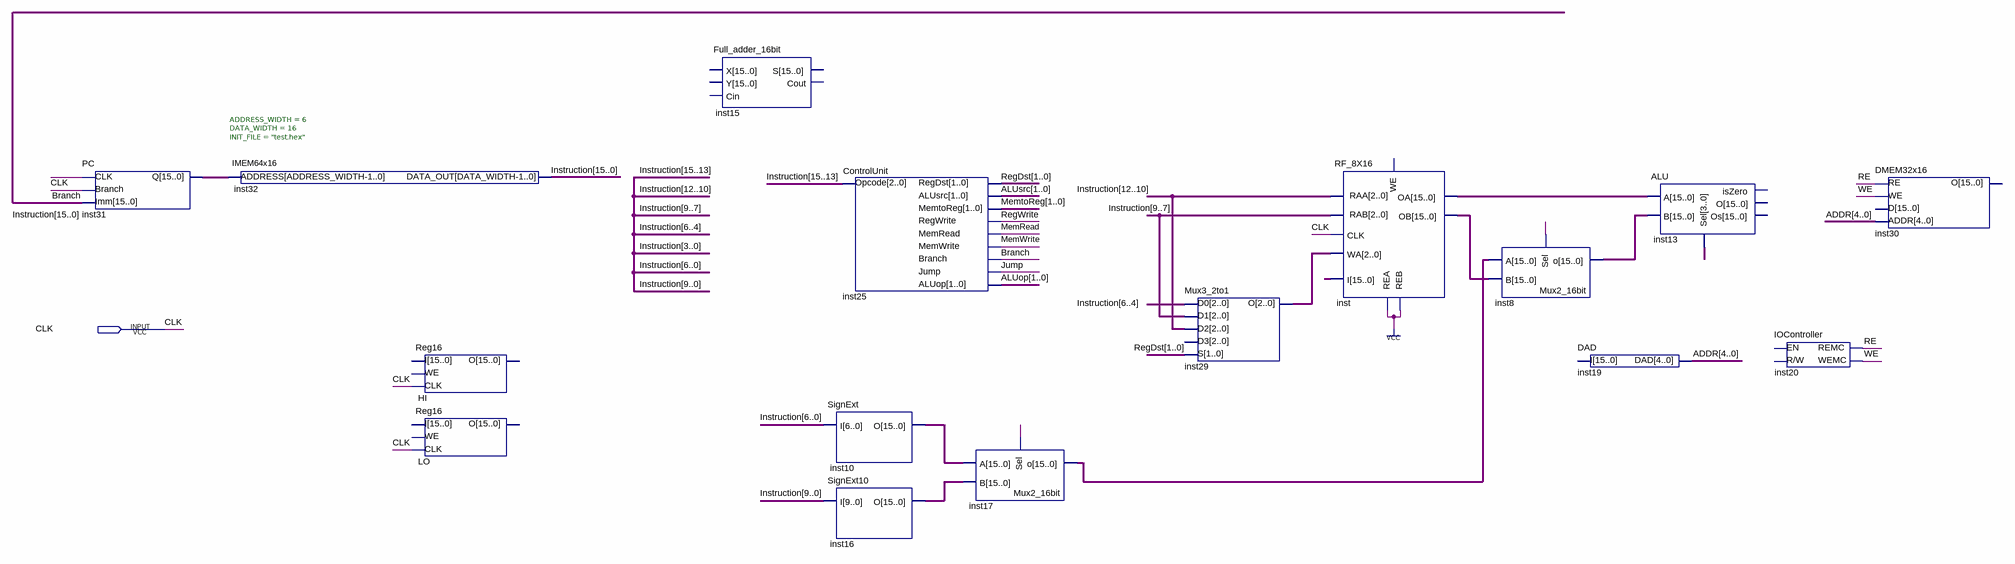
[diagram p0: schematic sheet]
// Quartus schematic CPUTopDesign_sub.bdf as structural Verilog: 16 symbols, 1 pins
module CPUTopDesign_sub (
  input  CLK
);

  wire Branch, Jump, MemRead, MemWrite, RE, RegWrite, undriven, undriven_3, WE;
  wire [1:0] ALUop, ALUsrc, MemtoReg, RegDst;
  wire [2:0] inst29_o;
  wire [3:0] undriven_2;
  wire [4:0] ADDR;
  wire [15:0] inst8_o, inst10_o, inst16_o, inst17_o, inst31_q, inst_oa, inst_ob, Instruction, undriven_4;

  PC inst31 (.CLK(CLK), .Branch(Branch), .Imm(Instruction), .Q(inst31_q));
  IMEM64x16 #(.ADDRESS_WIDTH(6), .DATA_WIDTH(16), .INIT_FILE("test.hex")) inst32 (
    .ADDRESS(inst31_q), .DATA_OUT(Instruction));
  Reg16 HI (.CLK(CLK));  // open: WE, I, O
  Reg16 LO (.CLK(CLK));  // open: WE, I, O
  Full_adder_16bit inst15 ();  // open: X, Y, Cin, S, Cout
  SignExt inst10 (.I(Instruction[6:0]), .O(inst10_o));
  SignExt10 inst16 (.I(Instruction[9:0]), .O(inst16_o));
  ControlUnit inst25 (
    .Opcode(Instruction[15:13]), .RegDst(RegDst), .ALUsrc(ALUsrc), .MemtoReg(MemtoReg), .RegWrite(RegWrite),
    .MemRead(MemRead), .MemWrite(MemWrite), .Branch(Branch), .Jump(Jump), .ALUop(ALUop));
  Mux2_16bit inst17 (.Sel(undriven), .A(inst10_o), .B(inst16_o), .o(inst17_o));
  Mux3_2to1 inst29 (
    .S(RegDst), .D0(Instruction[6:4]), .D1(Instruction[9:7]), .D2(Instruction[12:10]), .O(inst29_o));  // open: D3
  RF_8X16 inst (
    .I(undriven_4), .WA(inst29_o), .RAA(Instruction[12:10]), .REA(1'b1), .RAB(Instruction[9:7]), .REB(1'b1),
    .CLK(CLK), .OB(inst_ob), .OA(inst_oa));  // open: WE
  Mux2_16bit inst8 (.Sel(undriven_3), .A(inst17_o), .B(inst_ob), .o(inst8_o));
  DAD inst19 (.DAD(ADDR));  // open: I
  ALU inst13 (.Sel(undriven_2), .A(inst_oa), .B(inst8_o));  // open: O, Os, isZero
  IOController inst20 (.REMC(RE), .WEMC(WE));  // open: EN, R/W
  DMEM32x16 inst30 (.RE(RE), .WE(WE), .ADDR(ADDR));  // open: D, O
endmodule
